# EAGLE design hub (EAGLE 9.6.2)
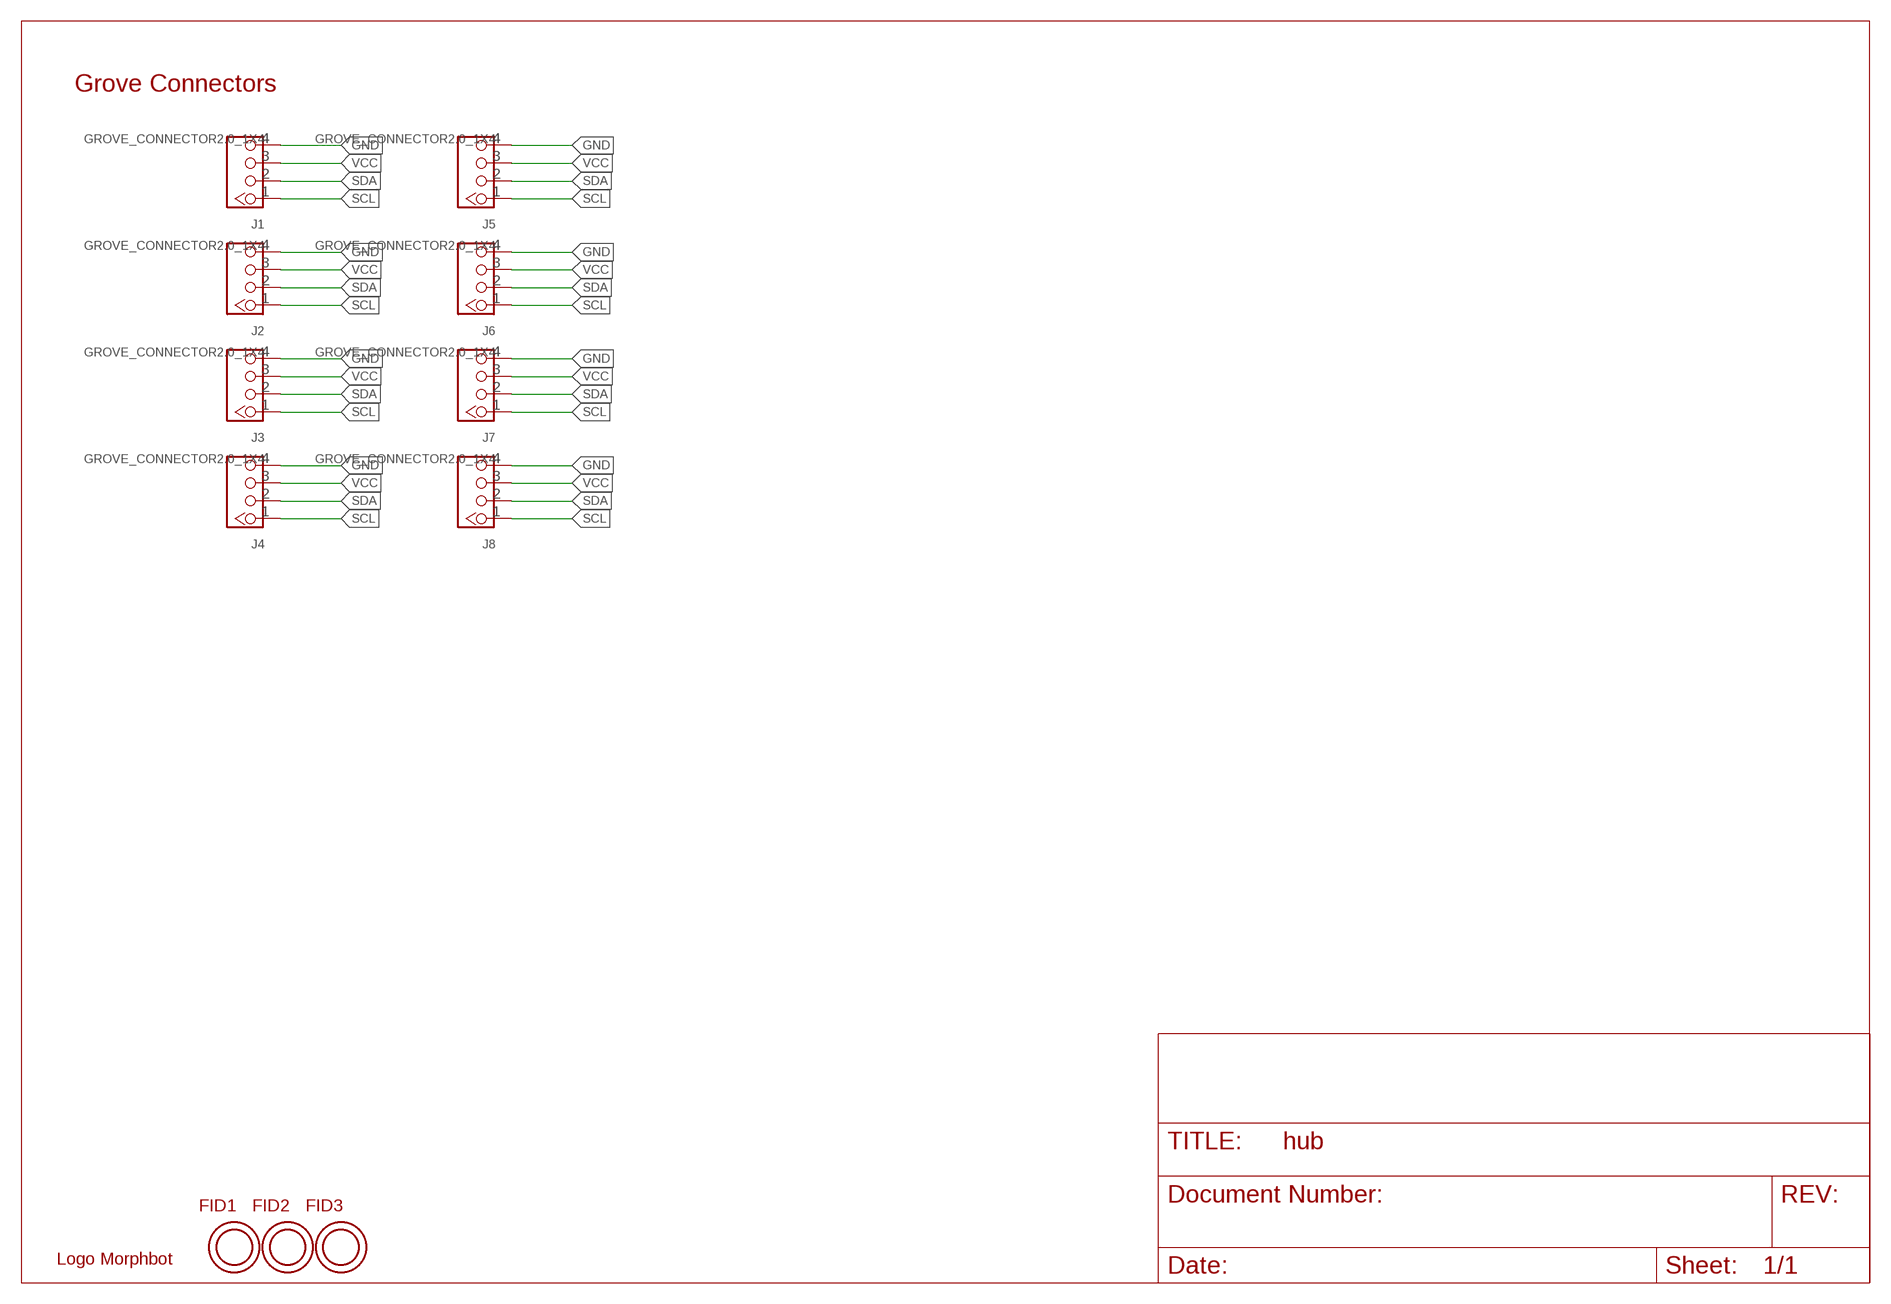
[diagram p0: schematic, sheet 1]

## Parts
FID1  OPEN-PNP-FIDUCIAL  [OPEN-PNP-FIDUCIAL]
FID2  OPEN-PNP-FIDUCIAL  [OPEN-PNP-FIDUCIAL]
FID3  OPEN-PNP-FIDUCIAL  [OPEN-PNP-FIDUCIAL]
J1  GROVE_CONNECTOR2.0_1X4  [2.0_1X4_STRAIGHT]
J2  GROVE_CONNECTOR2.0_1X4  [2.0_1X4_STRAIGHT]
J3  GROVE_CONNECTOR2.0_1X4  [2.0_1X4_STRAIGHT]
J4  GROVE_CONNECTOR2.0_1X4  [2.0_1X4_STRAIGHT]
J5  GROVE_CONNECTOR2.0_1X4  [2.0_1X4_STRAIGHT]
J6  GROVE_CONNECTOR2.0_1X4  [2.0_1X4_STRAIGHT]
J7  GROVE_CONNECTOR2.0_1X4  [2.0_1X4_STRAIGHT]
J8  GROVE_CONNECTOR2.0_1X4  [2.0_1X4_STRAIGHT]
U$1  LOGO_MORPHBOT5MM  [LOGO_MORPHBOT]

## Nets
GND: J1.4 J2.4 J3.4 J4.4 J5.4 J6.4 J7.4 J8.4
SCL: J1.1 J2.1 J3.1 J4.1 J5.1 J6.1 J7.1 J8.1
SDA: J1.2 J2.2 J3.2 J4.2 J5.2 J6.2 J7.2 J8.2
VCC: J1.3 J2.3 J3.3 J4.3 J5.3 J6.3 J7.3 J8.3

## Notes on the sheet
- Grove Connectors

## Library data of the parts
FID1-FID3 = topo-eng:OPEN-PNP-FIDUCIAL
J1-J8 = morphbot:GROVE_CONNECTOR: Seeedstudio Grove-Connector: 1 = SCL 2 = SDA 3 = VCC 4 = GND
U$1 = topo-eng:LOGO_MORPHBOT

## Board
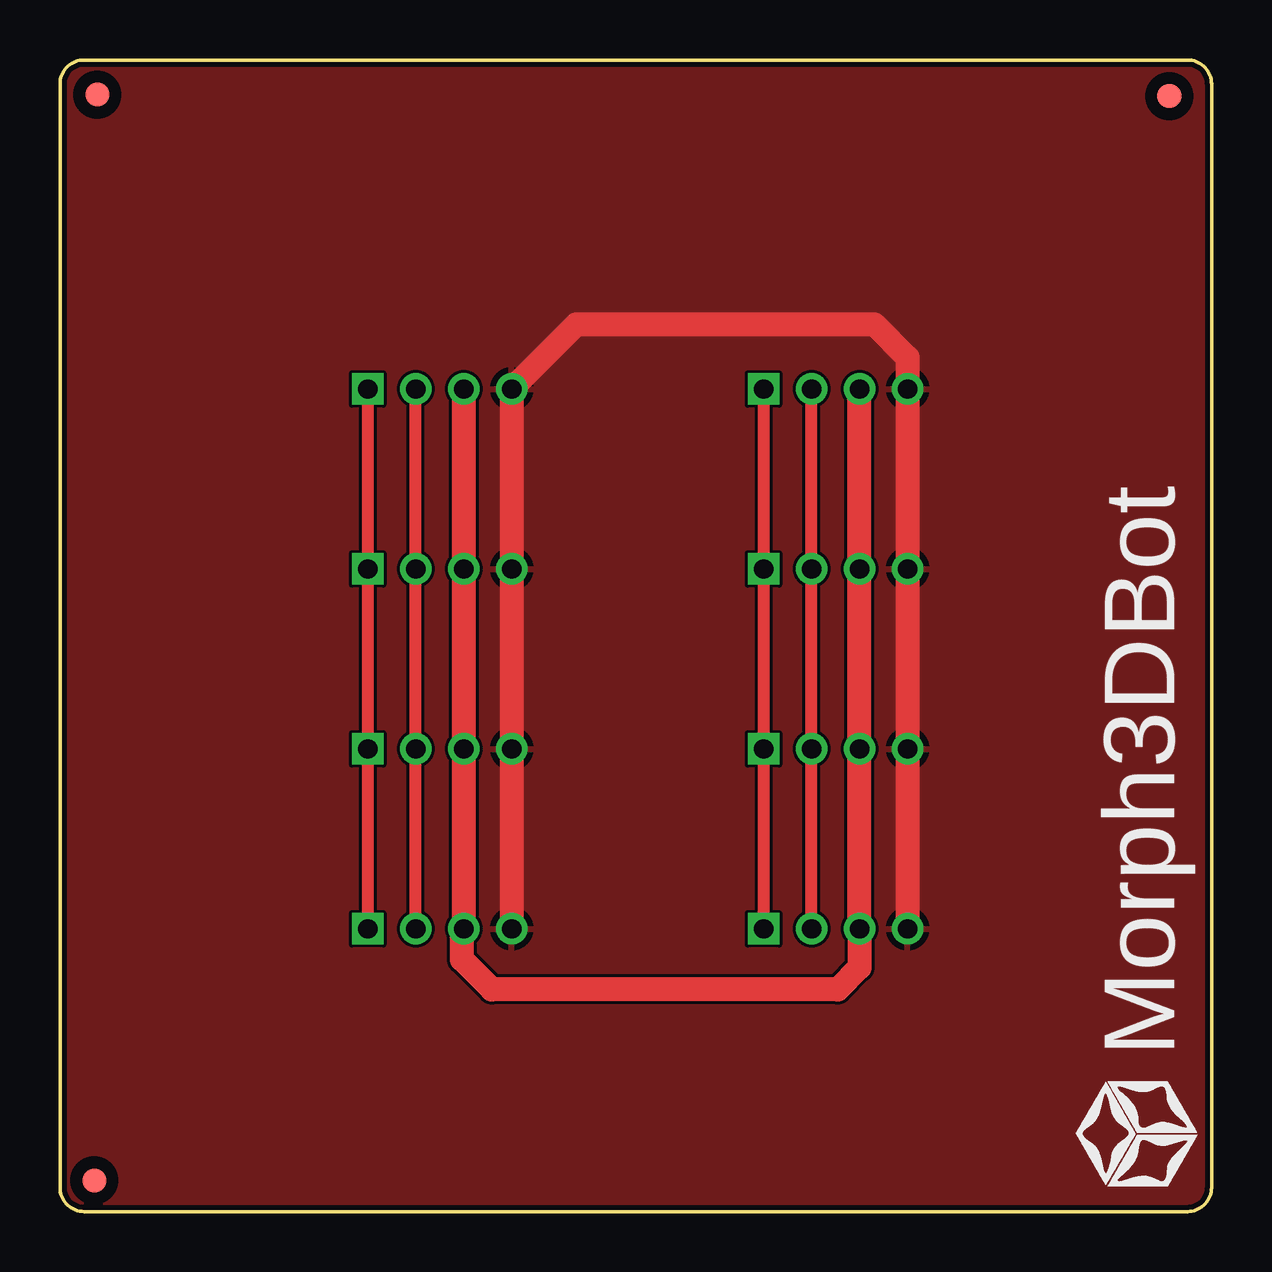
[diagram p1: board, top side]
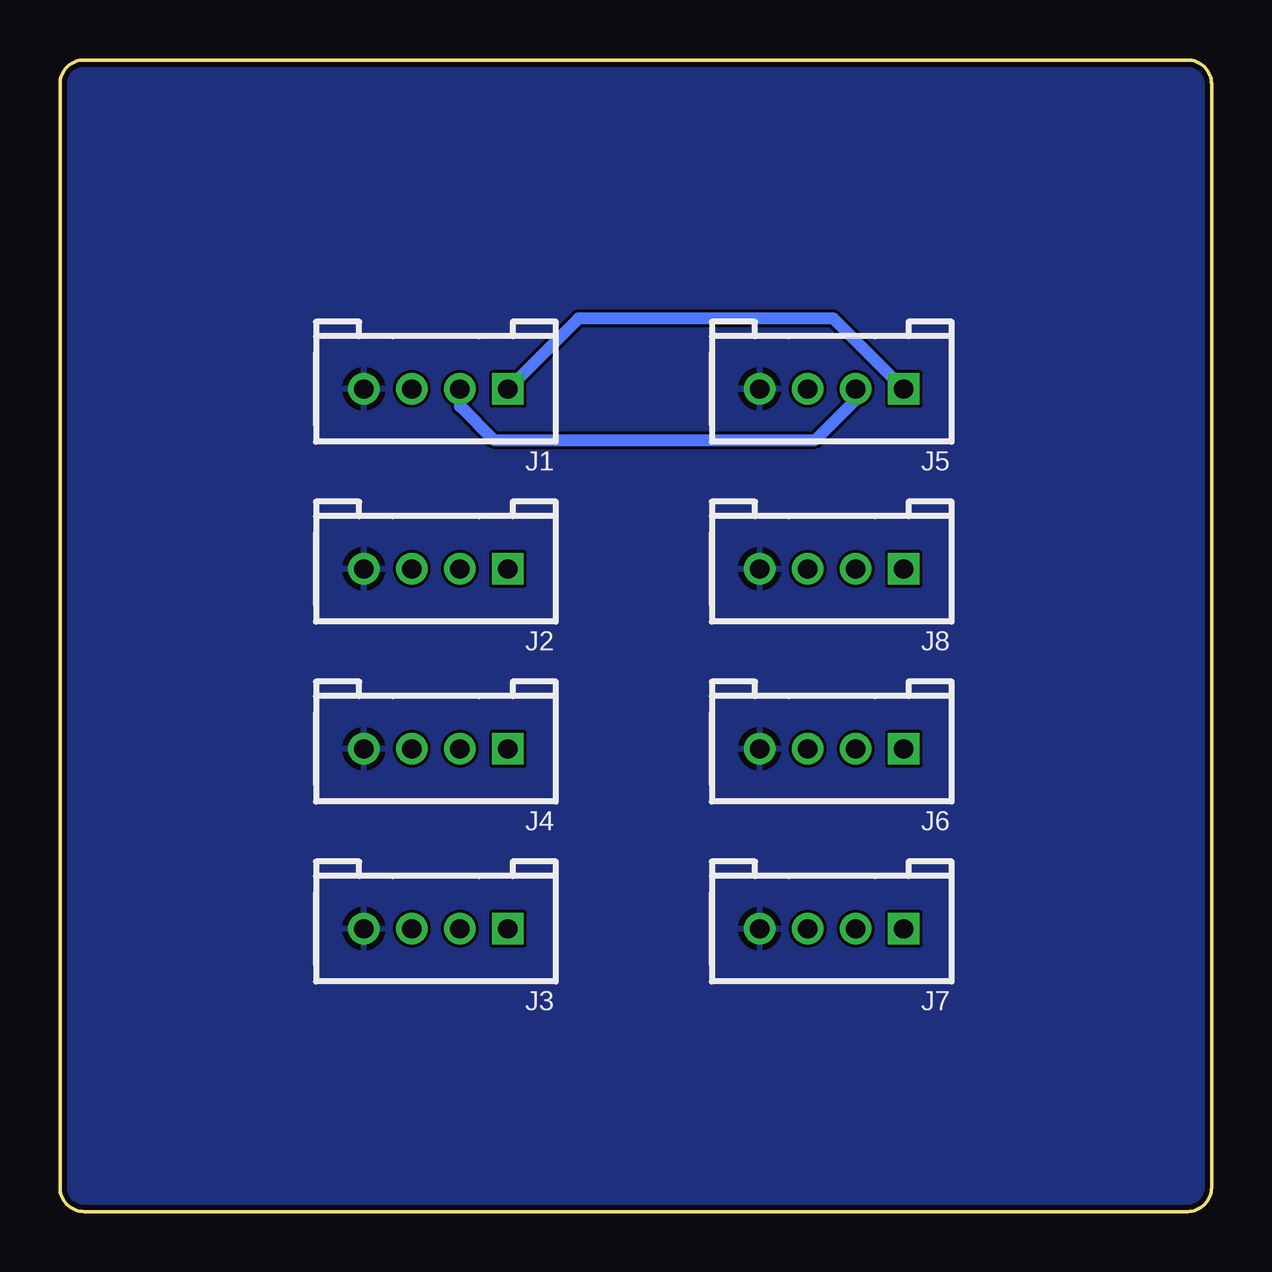
[diagram p2: board, bottom side, seen from below]

Size 48 x 48 mm. Coordinates in mm from the lower left corner, seen from the top.
Outline: 47,0 1,0 arc-90 0,1 0,47 arc-90 1,48 47,48 arc-90 48,47 48,1 arc-90 47,0
Copper layers (1*16): Top 0.035mm / dielectric 0.2mm / Bottom 0.035mm
Design rules "jlcpcb_4_layer *": minimum track width 3.5mil, minimum drill 0.2mm, track to track 5mil, track to pad 6mil, pad to pad 6mil, via to via 6mil, smd to smd 6mil, copper to edge 0.2mm, drill to drill 6mil, minimum pad ring 10mil, minimum via ring 8mil, stop-mask expansion 4mil, vias tented up to drill 0mil, thermal gap 10mil
bKeepout: area 24,0 to 48,48; area 0,0 to 24,48

### Footprints (pad centres in the part's own frame; a part is rotated, then mirrored left to right if it is on the bottom)
OPEN-PNP-FIDUCIAL = smd 1 x 1: FID$1 0,0
2.0_1X4_STRAIGHT = drill 0.8 pad 1.27 square: 1 1.83,-1.786 | drill 0.8 pad 1.27: 2 3.83,-1.786; 3 5.83,-1.786; 4 7.83,-1.786

### Placement (x,y rotation side)
FID1  1.43,1.3 0 top
FID2  1.56,46.56 0 top
FID3  46.24,46.49 0 top
J1  27.5,32.5 180 bottom
J2  27.5,25 180 bottom
J3  27.5,10 180 bottom
J4  27.5,17.5 180 bottom
J5  11,32.5 180 bottom
J6  11,17.5 180 bottom
J7  11,10 180 bottom
J8  11,25 180 bottom
U$1  47.66,0.49 90 top

### Tracks (layer width: path | path; a pad name or v marks a point on that pad's centre or on a via)
GND
  Top 1: J7.4 J6.4 J8.4 J5.4 21.52,36.98 33.95,36.98 35.33,35.6 J1.4 J2.4 J4.4 J3.4
  pour Bottom: 1,0 arc-90 0,1 0,47 arc-90 1,48 47,48 arc-90 48,47 48,1 arc-90 47,0
  pour Top: 1,0 arc-90 0,1 0,47 arc-90 1,48 47,48 arc-90 48,47 48,1 arc-90 47,0
SCL
  Top 0.5: J5.1 J8.1 J6.1 J7.1 | J1.1 J2.1 J4.1 J3.1
  Bottom 0.5: J5.1 15.77,37.22 26.39,37.22 J1.1
SDA
  Top 0.5: J7.2 J6.2 J8.2 J5.2 | J3.2 J4.2 J2.2 J1.2
  Bottom 0.5: J1.2 31.33,33.57 29.92,32.17 16.52,32.17 14.83,33.85 J5.2
VCC
  Top 1: J5.3 J8.3 J6.3 J7.3 16.76,11.72 16.76,10.51 18.01,9.26 32.42,9.26 33.33,10.17 J3.3 J4.3 J2.3 J1.3